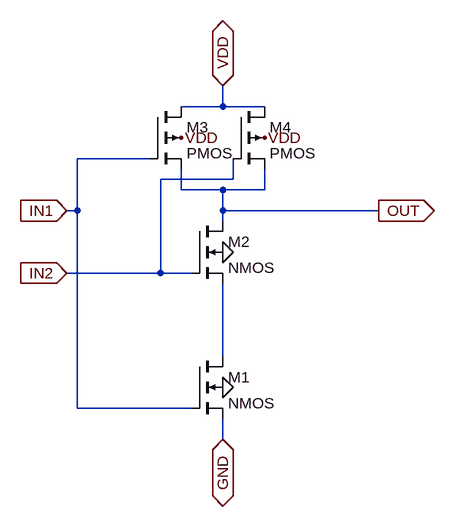
[diagram p0: schematic NAND_NAND.asc]
NAND_NAND.asc, the LTspice schematic file:
Version 4
SHEET 1 880 680
WIRE 352 -80 352 -112
WIRE 352 -80 288 -80
WIRE 416 -80 352 -80
WIRE 240 0 128 0
WIRE 368 32 368 0
WIRE 368 32 256 32
WIRE 288 48 288 16
WIRE 352 48 288 48
WIRE 416 48 416 16
WIRE 416 48 352 48
WIRE 128 80 128 0
WIRE 128 80 112 80
WIRE 352 80 352 48
WIRE 592 80 352 80
WIRE 352 96 352 80
WIRE 256 176 256 32
WIRE 256 176 112 176
WIRE 304 176 256 176
WIRE 352 304 352 192
WIRE 128 384 128 80
WIRE 304 384 128 384
WIRE 352 432 352 400
FLAG 352 432 GND
IOPIN 352 432 BiDir
FLAG 112 80 IN1
IOPIN 112 80 In
FLAG 112 176 IN2
IOPIN 112 176 In
FLAG 352 -112 VDD
IOPIN 352 -112 BiDir
FLAG 592 80 OUT
IOPIN 592 80 Out
FLAG 352 144 0
FLAG 352 352 0
FLAG 288 -32 VDD
FLAG 416 -32 VDD
SYMBOL nmos4 304 304 R0
SYMATTR InstName M1
SYMATTR Value2 l=180n w=2u
SYMBOL nmos4 304 96 R0
SYMATTR InstName M2
SYMATTR Value2 l=180n w=2u
SYMBOL pmos4 240 -80 R0
SYMATTR InstName M3
SYMATTR Value2 l=180n w=300n
SYMBOL pmos4 368 -80 R0
SYMATTR InstName M4
SYMATTR Value2 l=180n w=300n

The netlist it stands for:
* NAND_NAND.asc
M1 N001 IN1 GND 0 NMOS l=180n w=2u
M2 OUT IN2 N001 0 NMOS l=180n w=2u
M3 VDD IN1 OUT VDD PMOS l=180n w=300n
M4 VDD IN2 OUT VDD PMOS l=180n w=300n
.model NMOS NMOS
.model PMOS PMOS
.lib standard.mos
.backanno
.end